# Altium schematic sheet x-IMU3-SA-AX.SchDoc
size A3; SheetNumber: 1; SheetTotal: 1
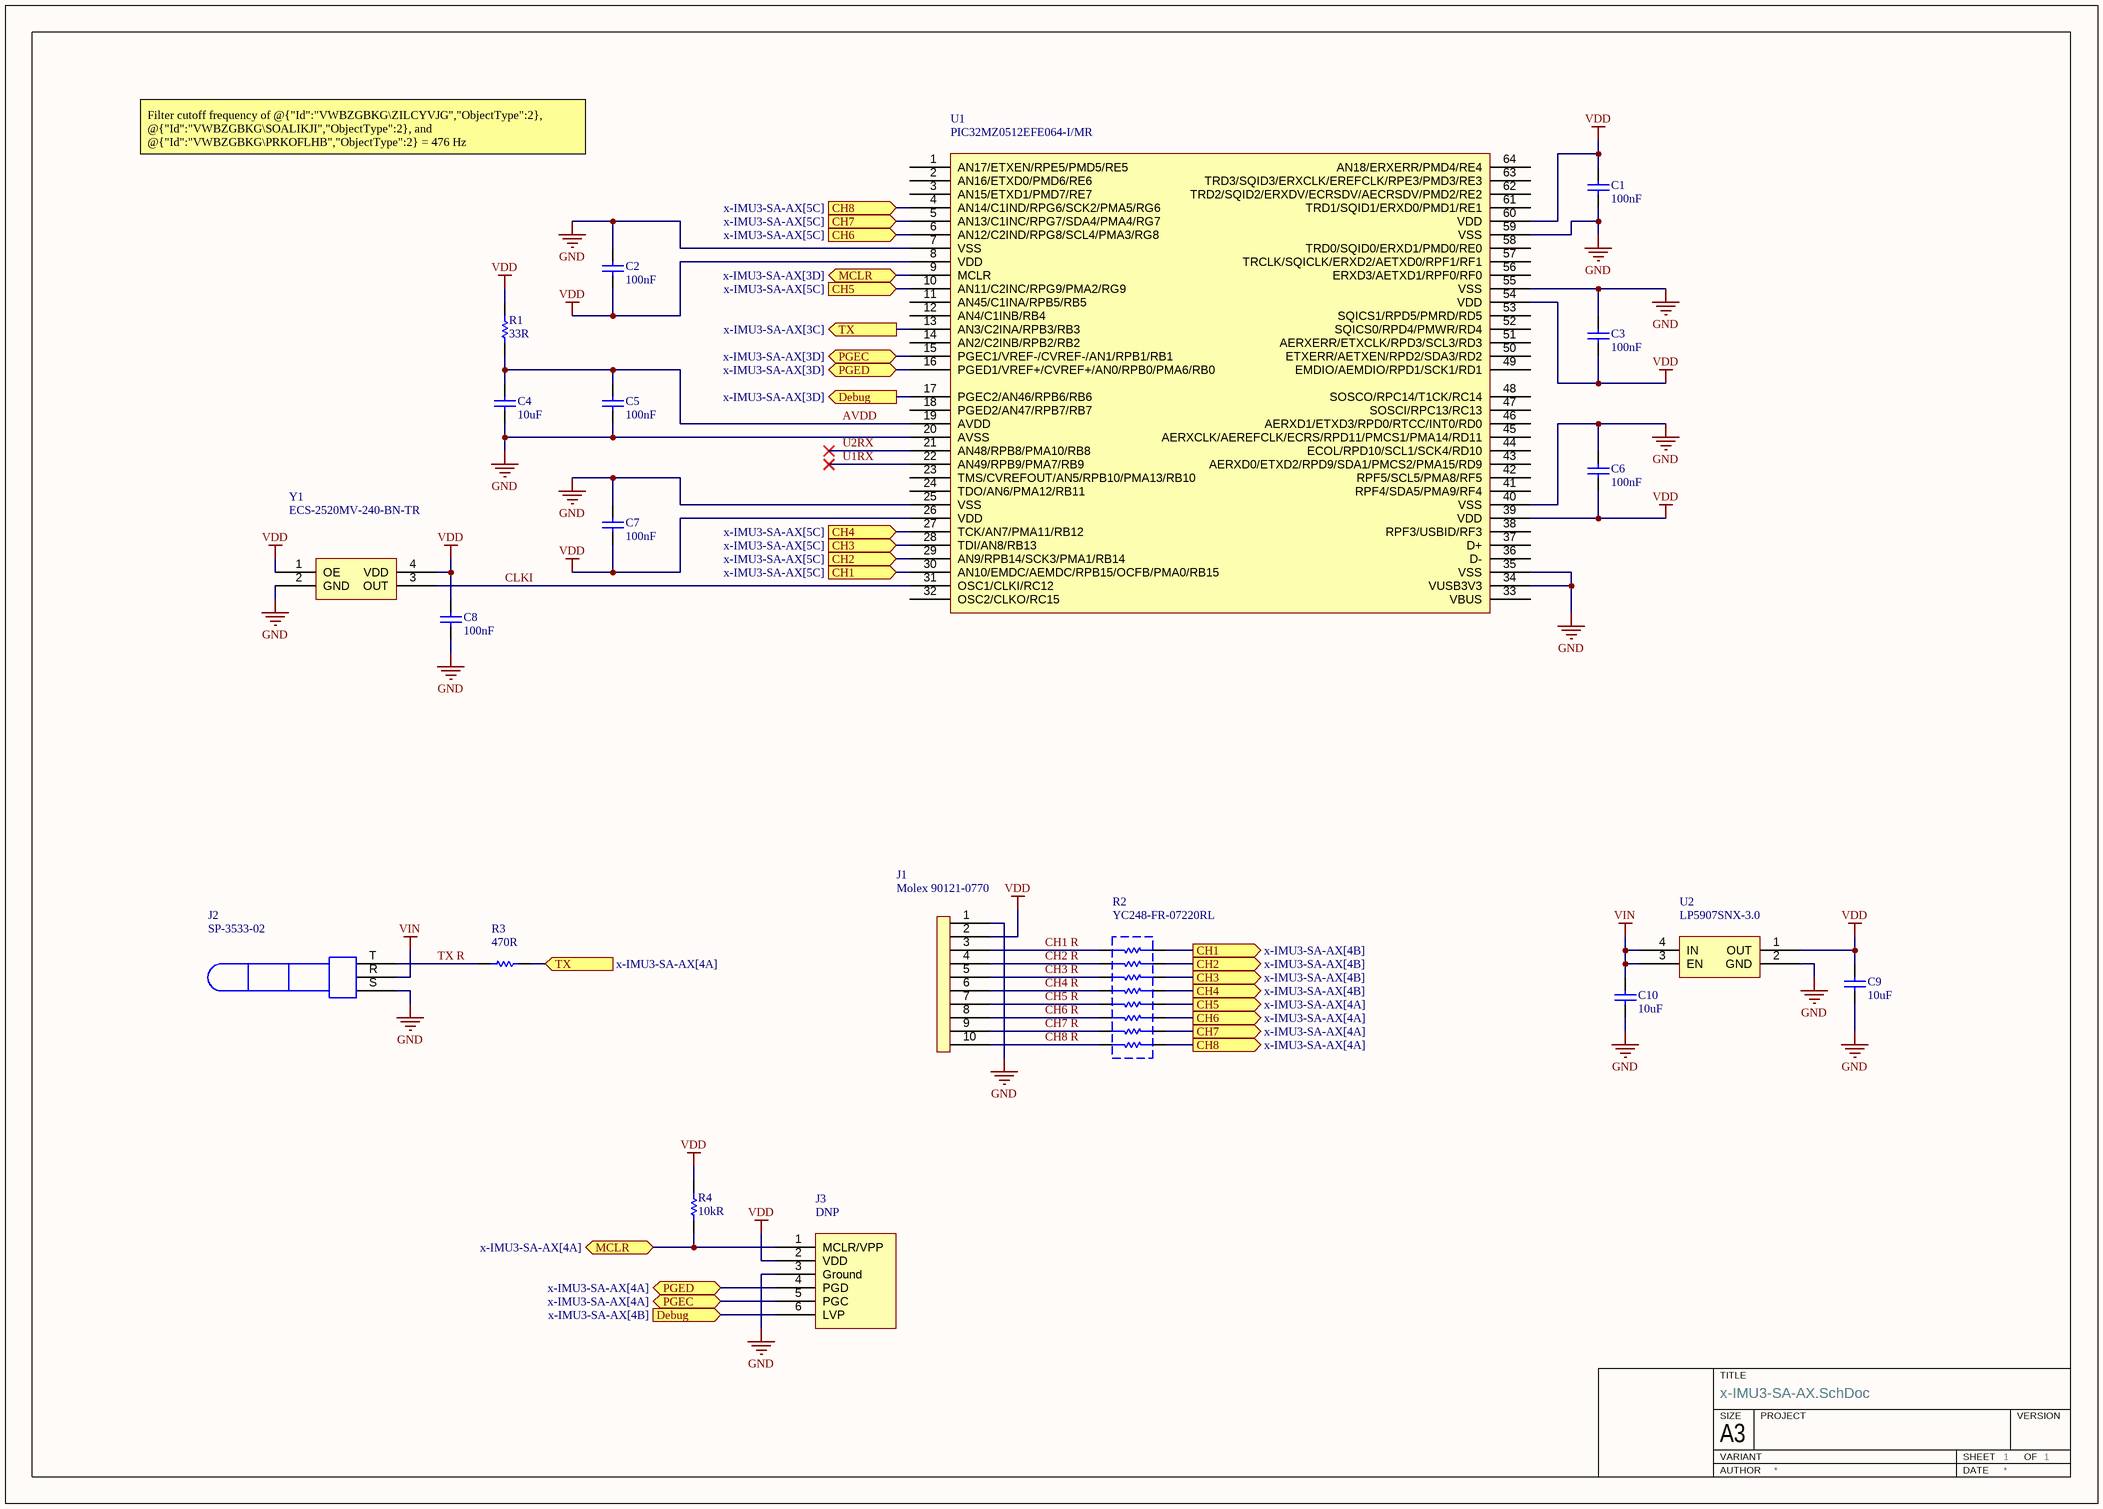
[diagram p0: x-IMU3-SA-AX.SchDoc]

## Parts
C1  100nF  [Capacitor 0402]
C2  100nF  [Capacitor 0402]
C3  100nF  [Capacitor 0402]
C4  10uF  [Capacitor 0402]
C5  100nF  [Capacitor 0402]
C6  100nF  [Capacitor 0402]
C7  100nF  [Capacitor 0402]
C8  100nF  [Capacitor 0402]
C9  10uF  [Capacitor 0402]
C10  10uF  [Capacitor 0402]
J1  Molex 90121-0770  [Molex 90121-0770]
J2  SP-3533-02  [SP-3533-02]
J3  DNP  [Tag Connect No Legs]
R1  33R  [Resistor 0402]
R2  YC248-FR-07220RL  [YC248]
R3  470R  [Resistor 0402]
R4  10kR  [Resistor 0402]
U1  PIC32MZ0512EFE064-I/MR  [QFN-64]
U2  LP5907SNX-3.0  [X2SON]
Y1  ECS-2520MV-240-BN-TR  [ECS 2x2.5mm]

## Ports
CH1 (in, see x-IMU3-SA-AX[5C]), CH1 (out, see x-IMU3-SA-AX[4B]), CH2 (in, see x-IMU3-SA-AX[5C]), CH2 (out, see x-IMU3-SA-AX[4B]), CH3 (in, see x-IMU3-SA-AX[5C]), CH3 (out, see x-IMU3-SA-AX[4B]), CH4 (in, see x-IMU3-SA-AX[5C]), CH4 (out, see x-IMU3-SA-AX[4B]), CH5 (in, see x-IMU3-SA-AX[5C]), CH5 (out, see x-IMU3-SA-AX[4A]), CH6 (in, see x-IMU3-SA-AX[5C]), CH6 (out, see x-IMU3-SA-AX[4A]), CH7 (in, see x-IMU3-SA-AX[5C]), CH7 (out, see x-IMU3-SA-AX[4A]), CH8 (in, see x-IMU3-SA-AX[5C]), CH8 (out, see x-IMU3-SA-AX[4A]), Debug (in, see x-IMU3-SA-AX[4B]), Debug (out, see x-IMU3-SA-AX[3D]), MCLR (bidir, see x-IMU3-SA-AX[3D]), MCLR (bidir, see x-IMU3-SA-AX[4A]), PGEC (bidir, see x-IMU3-SA-AX[3D]), PGEC (bidir, see x-IMU3-SA-AX[4A]), PGED (bidir, see x-IMU3-SA-AX[3D]), PGED (bidir, see x-IMU3-SA-AX[4A]), TX (in, see x-IMU3-SA-AX[4A]), TX (out, see x-IMU3-SA-AX[3C])

## Nets
GND: C1.1 C2.2 C3.2 C4.1 C5.1 C6.2 C7.2 C8.1 C9.1 C10.1 J1.1 J2.S J3.3(Ground) U1.7(VSS) U1.20(AVSS) U1.25(VSS) U1.34(VUSB3V3) U1.35(VSS) U1.40(VSS) U1.55(VSS) U1.59(VSS) U2.2(GND) Y1.2(GND)
VDD: C1.2 C2.1 C3.1 C6.1 C7.1 C8.2 C9.2 J1.2 J3.2(VDD) R1.2 R4.2 U1.8(VDD) U1.26(VDD) U1.39(VDD) U1.54(VDD) U1.60(VDD) U2.1(OUT) Y1.1(OE) Y1.4(VDD)
VIN: C10.2 J2.R U2.3(EN) U2.4(IN)
AVDD: C4.2 C5.2 R1.1 U1.19(AVDD)
CH1: R2.1 U1.30(AN10/EMDC/AEMDC/RPB15/OCFB/PMA0/RB15) ; port CH1
CH1 R: J1.3 R2.16
CH2: R2.2 U1.29(AN9/RPB14/SCK3/PMA1/RB14) ; port CH2
CH2 R: J1.4 R2.15
CH3: R2.3 U1.28(TDI/AN8/RB13) ; port CH3
CH3 R: J1.5 R2.14
CH4: R2.4 U1.27(TCK/AN7/PMA11/RB12) ; port CH4
CH4 R: J1.6 R2.13
CH5: R2.5 U1.10(AN11/C2INC/RPG9/PMA2/RG9) ; port CH5
CH5 R: J1.7 R2.12
CH6: R2.6 U1.6(AN12/C2IND/RPG8/SCL4/PMA3/RG8) ; port CH6
CH6 R: J1.8 R2.11
CH7: R2.7 U1.5(AN13/C1INC/RPG7/SDA4/PMA4/RG7) ; port CH7
CH7 R: J1.9 R2.10
CH8: R2.8 U1.4(AN14/C1IND/RPG6/SCK2/PMA5/RG6) ; port CH8
CH8 R: J1.10 R2.9
CLKI: U1.31(OSC1/CLKI/RC12) Y1.3(OUT)
Debug: J3.6(LVP) U1.17(PGEC2/AN46/RPB6/RB6) ; port Debug
MCLR: J3.1(MCLR/VPP) R4.1 U1.9(MCLR) ; port MCLR
PGEC: J3.5(PGC) U1.15(PGEC1/VREF-/CVREF-/AN1/RPB1/RB1) ; port PGEC
PGED: J3.4(PGD) U1.16(PGED1/VREF+/CVREF+/AN0/RPB0/PMA6/RB0) ; port PGED
TX: R3.2 U1.13(AN3/C2INA/RPB3/RB3) ; port TX
TX R: J2.T R3.1
U1RX: U1.22(AN49/RPB9/PMA7/RB9)
U2RX: U1.21(AN48/RPB8/PMA10/RB8)

Not connected (* = marked no-connect by the designer): U1 1(AN17/ETXEN/RPE5/PMD5/RE5) 2(AN16/ETXD0/PMD6/RE6) 3(AN15/ETXD1/PMD7/RE7) 11(AN45/C1INA/RPB5/RB5) 12(AN4/C1INB/RB4) 14(AN2/C2INB/RPB2/RB2) 18(PGED2/AN47/RPB7/RB7) 23(TMS/CVREFOUT/AN5/RPB10/PMA13/RB10) 24(TDO/AN6/PMA12/RB11) 32(OSC2/CLKO/RC15) 33(VBUS) 36(D-) 37(D+) 38(RPF3/USBID/RF3) 41(RPF4/SDA5/PMA9/RF4) 42(RPF5/SCL5/PMA8/RF5) 43(AERXD0/ETXD2/RPD9/SDA1/PMCS2/PMA15/RD9) 44(ECOL/RPD10/SCL1/SCK4/RD10) 45(AERXCLK/AEREFCLK/ECRS/RPD11/PMCS1/PMA14/RD11) 46(AERXD1/ETXD3/RPD0/RTCC/INT0/RD0) 47(SOSCI/RPC13/RC13) 48(SOSCO/RPC14/T1CK/RC14) 49(EMDIO/AEMDIO/RPD1/SCK1/RD1) 50(ETXERR/AETXEN/RPD2/SDA3/RD2) 51(AERXERR/ETXCLK/RPD3/SCL3/RD3) 52(SQICS0/RPD4/PMWR/RD4) 53(SQICS1/RPD5/PMRD/RD5) 56(ERXD3/AETXD1/RPF0/RF0) 57(TRCLK/SQICLK/ERXD2/AETXD0/RPF1/RF1) 58(TRD0/SQID0/ERXD1/PMD0/RE0) 61(TRD1/SQID1/ERXD0/PMD1/RE1) 62(TRD2/SQID2/ERXDV/ECRSDV/AECRSDV/PMD2/RE2) 63(TRD3/SQID3/ERXCLK/EREFCLK/RPE3/PMD3/RE3) 64(AN18/ERXERR/PMD4/RE4)

## Notes on the sheet
- Filter cutoff frequency of @{"Id":"VWBZGBKG\ZILCYVJG","ObjectType":2}, @{"Id":"VWBZGBKG\SOALIKJI","ObjectType":2}, and @{"Id":"VWBZGBKG\PRKOFLHB","ObjectType":2} = 476 Hz
  Measured @{"Id":"VWBZGBKG\TYZZHXAP","ObjectType":1} current = 470uA.  Voltage drop through 33R = 16mV
  @{"Id":"VWBZGBKG\QQQECIQT","ObjectType":1} and @{"Id":"VWBZGBKG\JMTNHEZX","ObjectType":1}  require PIC32MZ internal pull-up to prevent spurious RX data
- TITLE
- SIZE
- A3
- VARIANT
- PROJECT
- SHEET
- VERSION
- OF
- AUTHOR
- DATE

## Library data of the parts
C1-C10 = Capacitor
J3 = MPLAB ICSP
R1 R3 R4 = Resistor
R2 = Resistor Array 8
U1 = PIC32MZ2048EFH064
U2 = LP5907SNX-X.X
Y1 = Oscillator